# EAGLE design usblink (EAGLE 7.7.0)
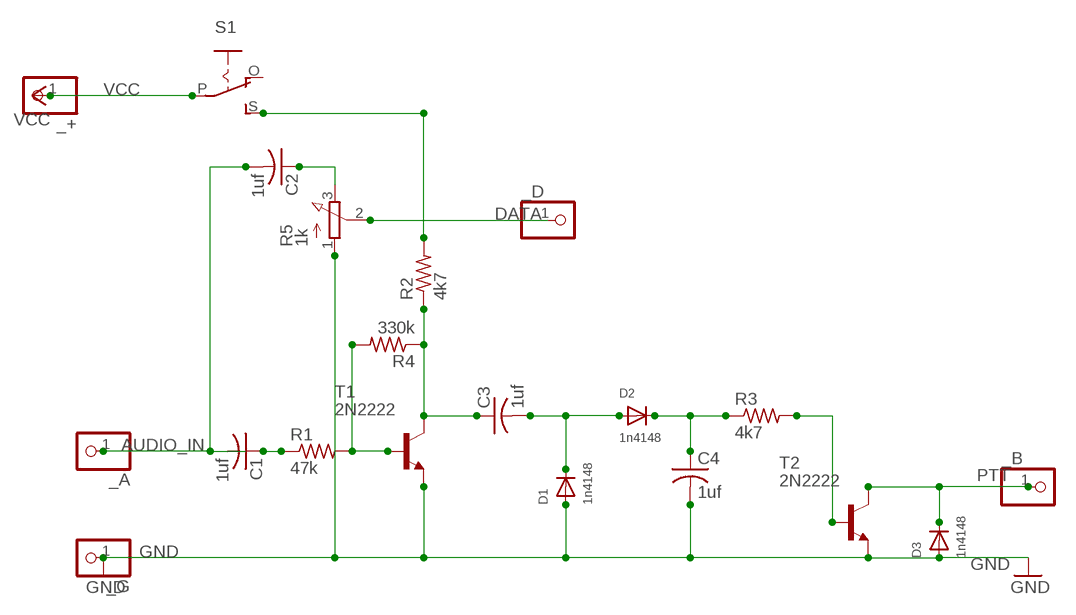
[diagram p0: schematic, sheet 1]

## Parts
_+  PINHD-1X1CB  [1X01-CLEANBIG]
_A  PINHD-1X1CB  [1X01-CLEANBIG]
_B  PINHD-1X1CB  [1X01-CLEANBIG]
_D  PINHD-1X1CB  [1X01-CLEANBIG]
_G  PINHD-1X1CB  [1X01-CLEANBIG]
C1  1uf  C-US025-030X050  [C025-030X050]
C2  1uf  C-US025-030X050  [C025-030X050]
C3  1uf  C-US025-030X050  [C025-030X050]
C4  1uf  C-US025-030X050  [C025-030X050]
D1  1n4148  DIODEDO-1N4148  [DO-1N4148]
D2  1n4148  DIODEDO-1N4148  [DO-1N4148]
D3  1n4148  DIODEDO-1N4148  [DO-1N4148]
R1  47k  R-US_0204/7  [0204/7]
R2  4k7  R-US_0204/7  [0204/7]
R3  4k7  R-US_0204/7  [0204/7]
R4  330k  R-US_0204/7  [0204/7]
R5  1k  3RP/1610N  [3RP/1610N]
S1  EG1218S  [EG1218]
T1  2N2222  [TO92-EBC-OVAL]
T2  2N2222  [TO92-EBC-OVAL]

## Nets
AUDIO_IN: _A.1 C1.2 C2.2
DATA: _D.1 R5.2(S)
GND: _G.1 C4.2 D1.A D3.A R5.1(A) T1.E T2.E
N$2: R2.2 S1.S
N$4: C2.1 R5.3(E)
N$5: C1.1 R1.1
N$6: R1.2 R4.2 T1.B
N$7: C3.1 R2.1 R4.1 T1.C
N$8: C3.2 D1.C D2.A
N$9: C4.1 D2.C R3.1
N$10: R3.2 T2.B
PTT: _B.1 D3.C T2.C
VCC: _+.1 S1.P
Unconnected: S1.O

## Library data of the parts
_+ _A _B _D _G = adafruit:PINHD-1X1: Pin header 1x1 for 0.1" spacing With round pins
C1-C4 = adafruit:C-US: CAPACITOR, American symbol
D1-D3 = adafruit:DIODE: Diode SMADIODE - SMA Surface Mount Package 20V 1A Schottky Diode Digikey: 641-1014-6-ND DO-1N4148 - Through Hole Small Current Diode SOD-123 20V 1 A (.5mV Vf) Schottky Diode - Digikey: MBRX120TPMSCT-ND SOD-323 10V 570mA (.38mV Vf, 3ns) Schottky Diode - Digikey: ZLLS410CT-ND SOD-523 30V 30mA Schottky Diode (RB751S-40TE61) - Digikey: RB751S-40TE61CT-ND SOT23-R/W - SOT23 Package (R = Solder Paste/Reflow Ovens, W = Hand-Soldering) BAT54Film 40V 300mA - Digikey: 497-7162-1-ND
R1-R4 = adafruit:R-US_: RESISTOR, American symbol
R5 = pot:3RP/1610N: 16mm Potentiometer one level Source: http://www.alphapotentiometers.net/html/16mm_pot_2.html
S1 = adafruit:EG1218: SLIDING SWITCH 0.1" spacing through hole, vertical SPDT slide switch http://www.ladyada.net/library/pcb/eaglelibrary.html
T1 T2 = adafruit:2N2222: NPN TRANSISTOR Big oval pads

## Net classes
0 default: width 0.381 mm, drill 0.508 mm, clearance 0.254 mm

## Board
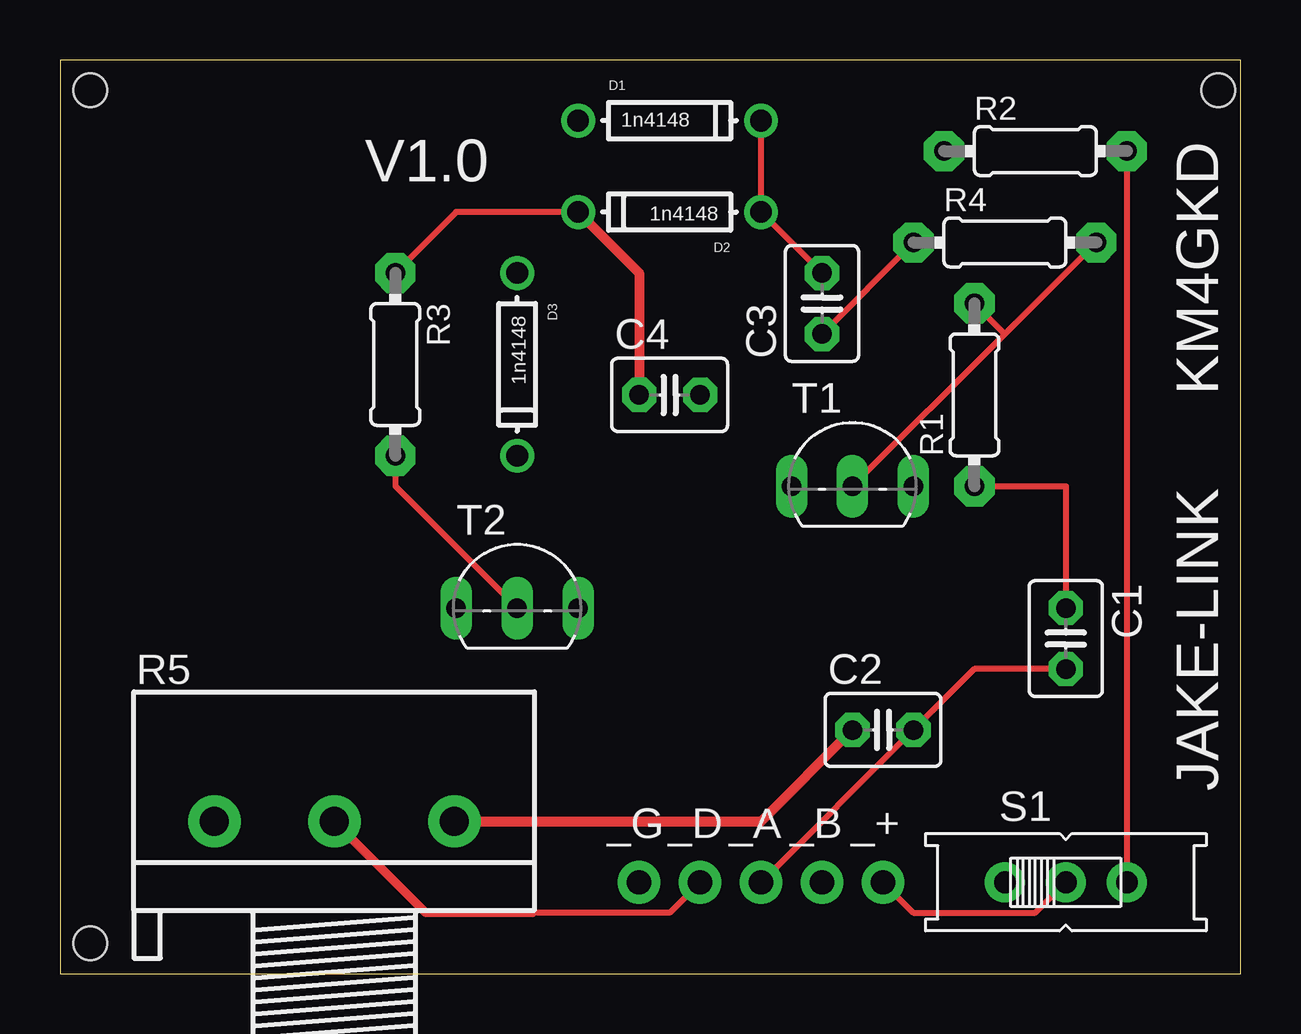
[diagram p1: board, top side]
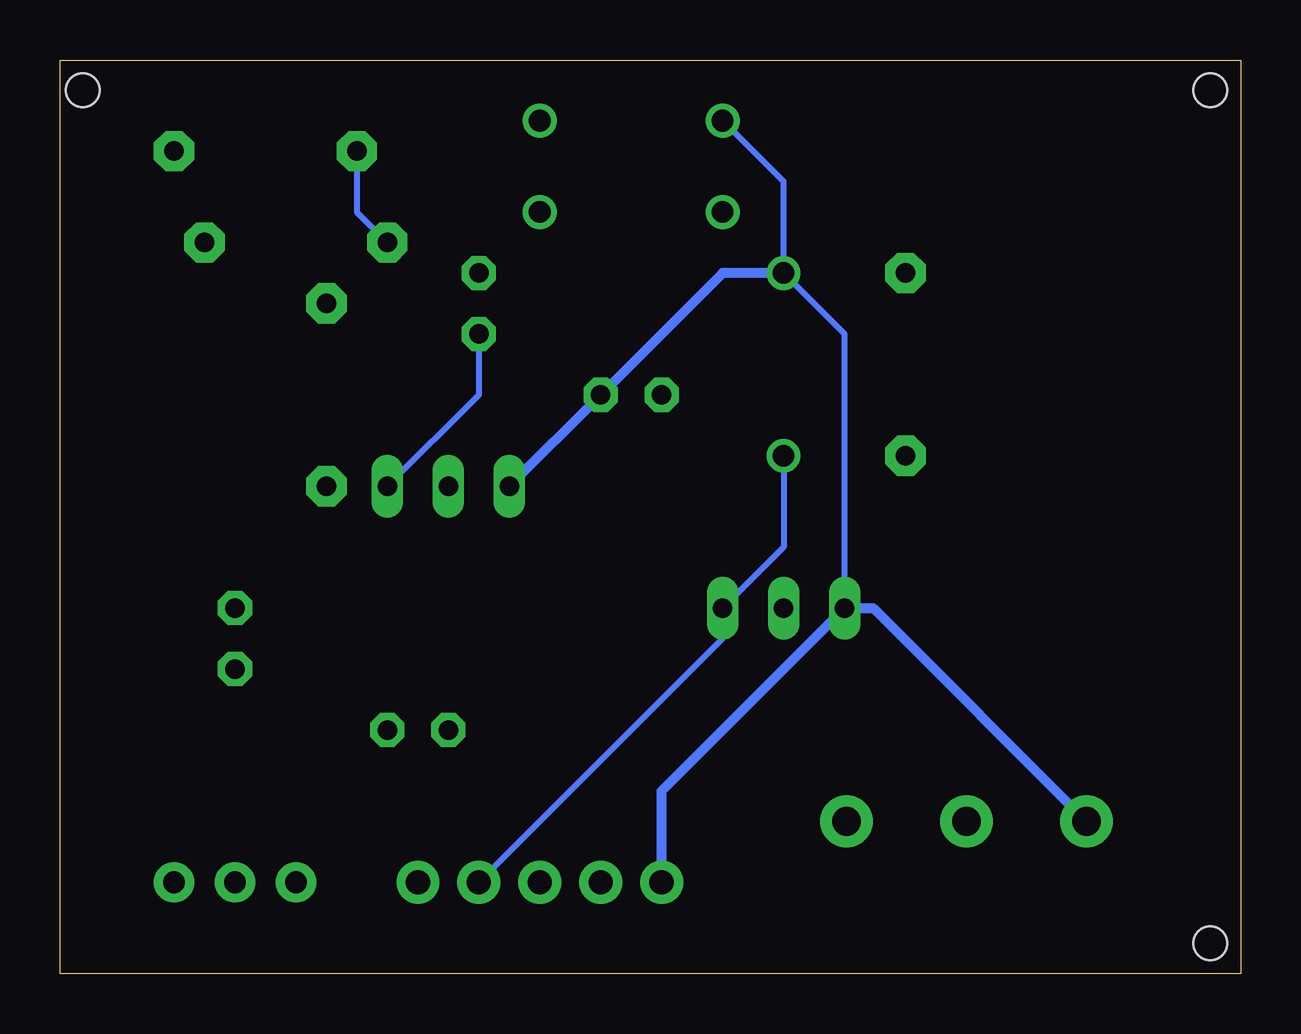
[diagram p2: board, bottom side, seen from below]

Size 49.2 x 38.09 mm. Coordinates in mm from the lower left corner, seen from the top.
Outline: 0,0 49.2,0 49.2,38.09 0,38.09 0,0
Copper layers (1*16): Top 0.035mm / dielectric 1.5mm / Bottom 0.035mm
Design rules "default": minimum track width 10mil, minimum drill 24mil, track to track 8mil, track to pad 8mil, pad to pad 8mil, via to via 8mil, smd to smd 8mil, copper to edge 40mil, drill to drill 8mil, minimum pad ring 10mil, minimum via ring 8mil, stop-mask expansion 4mil, vias tented up to drill 0mil, thermal gap 10mil
Holes 1.4 mm at 1.27,1.27 1.27,36.83 48.26,36.83

### Footprints (pad centres in the part's own frame; a part is rotated, then mirrored left to right if it is on the bottom)
1X01-CLEANBIG = drill 1.016 pad 1.778: 1 0,0
C025-030X050 = drill 0.813 pad 1.422 octagon: 1 -1.27,0; 2 1.27,0
DO-1N4148 = drill 0.9: A -3.81,0; C 3.81,0
0204/7 = drill 0.813 pad 1.676 octagon: 1 -3.81,0; 2 3.81,0
3RP/1610N = drill 1.2 pad 2.184: 1 -5,0; 2 0,0; 3 5,0
EG1218 = drill 0.9 pad 1.676: O -2.54,0; P 0,0; S 2.54,0
TO92-EBC-OVAL = drill 0.813 long: B 0,-1.27; C 2.54,-1.27; E -2.54,-1.27

### Placement (x,y rotation side)
_+  34.29,3.81 0 top
_A  29.21,3.81 0 top
_B  31.75,3.81 0 top
_D  26.67,3.81 0 top
_G  24.13,3.81 0 top
C1  41.91,13.97 270 top
C2  34.29,10.16 0 top
C3  31.75,27.94 90 top
C4  25.4,24.13 0 top
D1  25.4,35.56 0 top
D2  25.4,31.75 180 top
D3  19.05,25.4 270 top
R1  38.1,24.13 90 top
R2  40.64,34.29 0 top
R3  13.97,25.4 270 top
R4  39.37,30.48 0 top
R5  11.43,6.35 0 top
S1  41.91,3.81 0 top
T1  33.02,21.59 0 top
T2  19.05,16.51 0 top

### Tracks (layer width: path | path; a pad name or v marks a point on that pad's centre or on a via)
AUDIO_IN
  Top 0.254: C1.2 38.1,12.7 C2.2 _A.1
DATA
  Top 0.254: 19.68,2.54 25.4,2.54 _D.1
  Top 0.381: R5.2 15.24,2.54 19.68,2.54
GND
  Bottom 0.254: T2.E 16.51,26.67 D3.A 19.05,33.02 D1.A
  Bottom 0.406: _G.1 24.13,7.62 T2.E 15.32,15.24 R5.1 | D3.A 21.59,29.21 C4.2 T1.E
N$2
  Top 0.254: R2.2 S1.S
N$4
  Top 0.406: R5.3 29.21,6.35 C2.1
N$5
  Top 0.254: C1.1 41.91,20.32 R1.1
N$6
  Top 0.254: R4.2 39.37,26.67 | 39.37,26.67 T1.B | 39.37,26.67 R1.2
N$7
  Top 0.254: C3.1 R4.1
  Bottom 0.254: R4.1 36.83,31.75 R2.1 | T1.C 31.75,24.13 C3.1
N$8
  Top 0.254: C3.2 D2.A D1.C
N$9
  Top 0.254: R3.1 16.51,31.75 D2.C
  Top 0.406: D2.C 24.13,29.21 C4.1
N$10
  Top 0.254: T2.B 13.97,20.32 R3.2
PTT
  Bottom 0.254: D3.C 19.05,17.78 T2.C 21.59,13.97 _B.1
VCC
  Top 0.254: S1.P 40.64,2.54 35.56,2.54 _+.1

### Text on the board
tNames: V1.0 | KM4GKD | JAKE-LINK